# EAGLE design ai_pulsar (EAGLE 7.1.0)
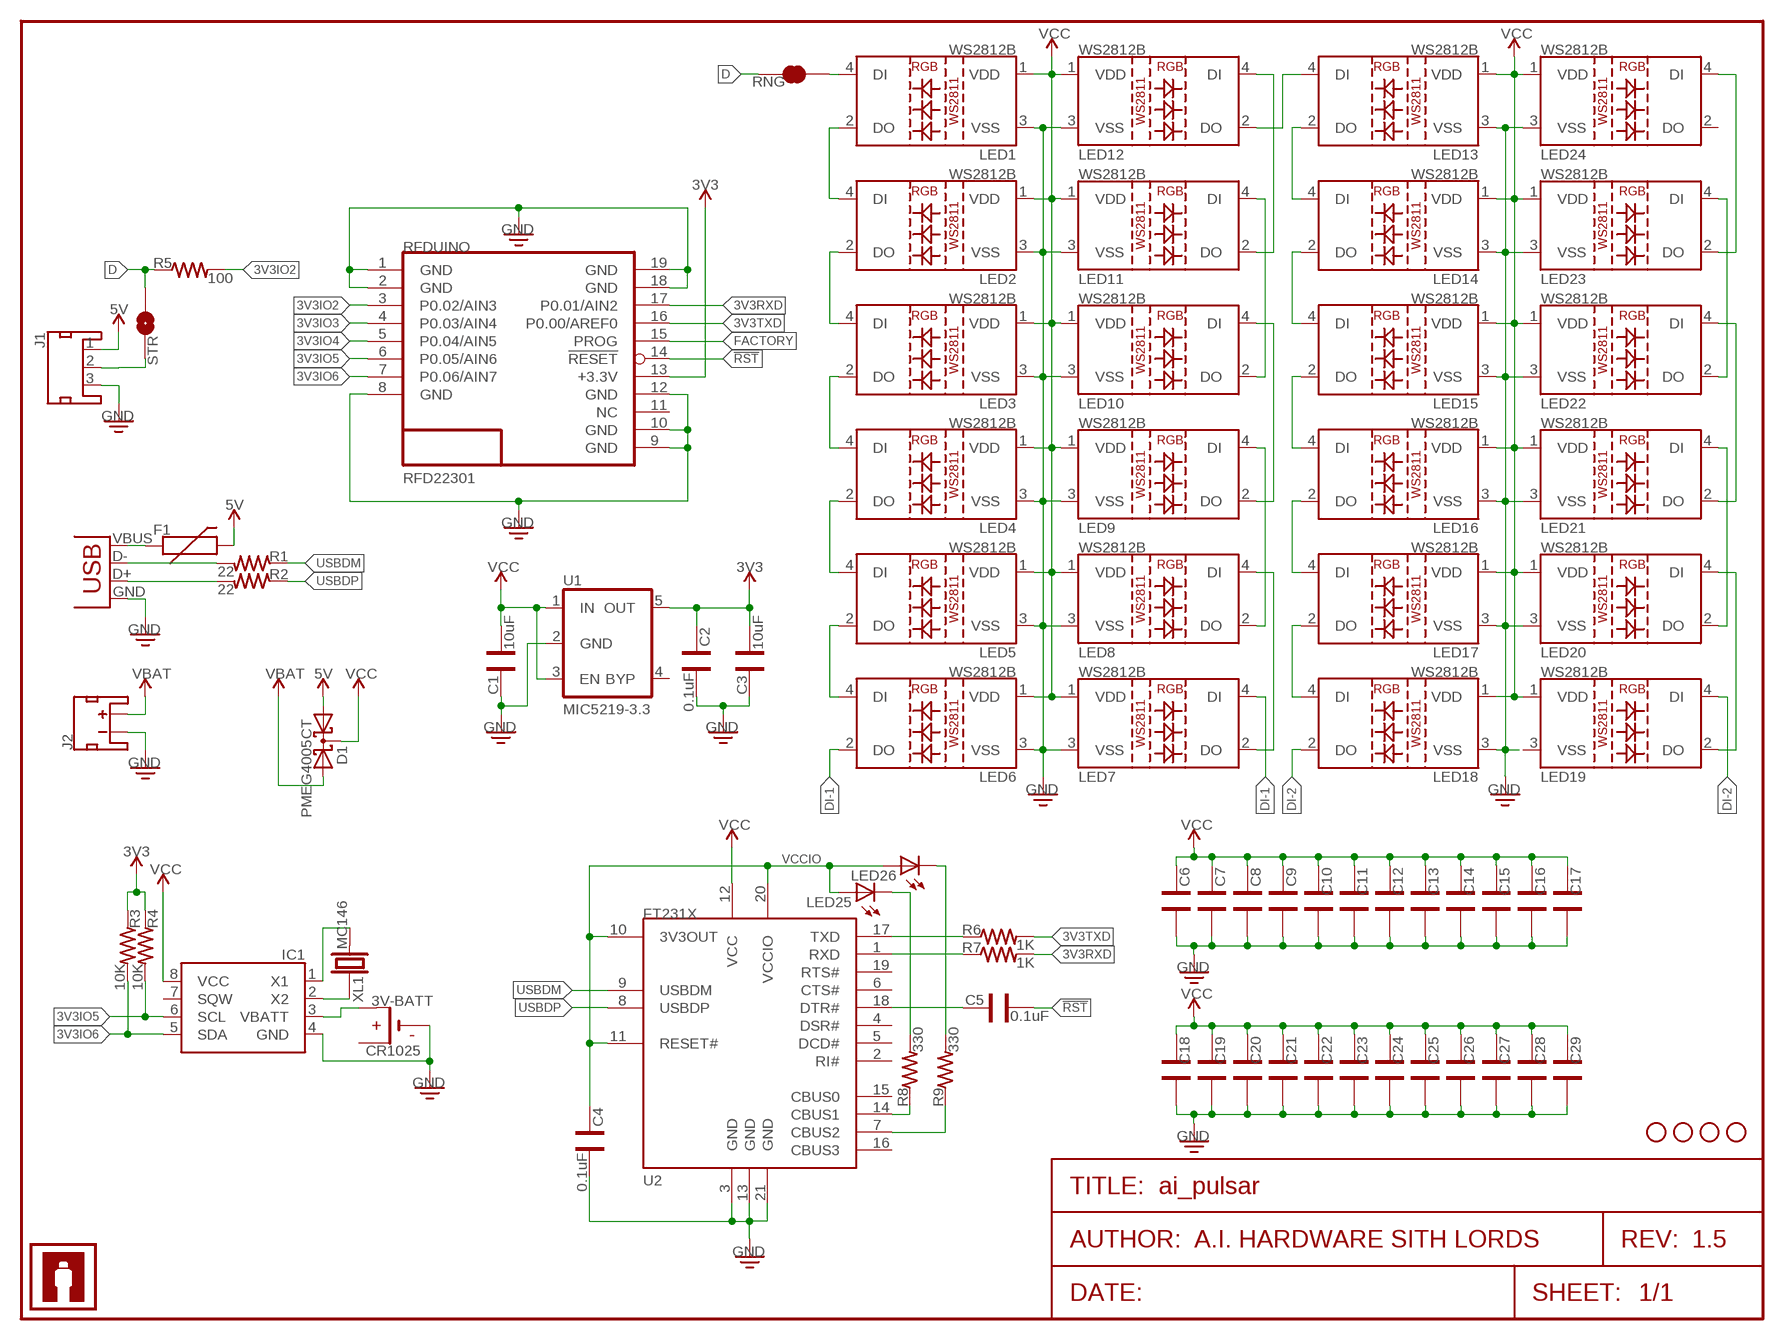
[diagram p0: schematic, sheet 1]
FRAME1 (FRAME-LETTER): AUTHOR: A.I. HARDWARE SITH LORDS; REV: 1.5

## Parts
3V-BATT  CR1025  [CR1025-SMD]
C1  10uF  CAP0603  [CAP-0603]
C2  0.1uF  CAP0603  [CAP-0603]
C3  10uF  CAP0603  [CAP-0603]
C4  0.1uF  CAP0603  [CAP-0603]
C5  0.1uF  CAP0603  [CAP-0603]
C6  CAP0603  [CAP-0603]
C7  CAP0603  [CAP-0603]
C8  CAP0603  [CAP-0603]
C9  CAP0603  [CAP-0603]
C10  CAP0603  [CAP-0603]
C11  CAP0603  [CAP-0603]
C12  CAP0603  [CAP-0603]
C13  CAP0603  [CAP-0603]
C14  CAP0603  [CAP-0603]
C15  CAP0603  [CAP-0603]
C16  CAP0603  [CAP-0603]
C17  CAP0603  [CAP-0603]
C18  CAP0603  [CAP-0603]
C19  CAP0603  [CAP-0603]
C20  CAP0603  [CAP-0603]
C21  CAP0603  [CAP-0603]
C22  CAP0603  [CAP-0603]
C23  CAP0603  [CAP-0603]
C24  CAP0603  [CAP-0603]
C25  CAP0603  [CAP-0603]
C26  CAP0603  [CAP-0603]
C27  CAP0603  [CAP-0603]
C28  CAP0603  [CAP-0603]
C29  CAP0603  [CAP-0603]
D1  PMEG4005CT  DIODE-SCHOTTKY-DUAL  [SOT-23]
F1  PTCSMD  [PTC-1206]
IC1  DS1307SO8-TIGHT  [SO08-TIGHT]
J1  JST-3P-MALE  [JST-3P-SMD]
J2  JST-2P-MALE  [JST-2P-SMD]
LED1  LED-WS2812B-SM  [LED-WS2812B-SM]
LED2  LED-WS2812B-SM  [LED-WS2812B-SM]
LED3  LED-WS2812B-SM  [LED-WS2812B-SM]
LED4  LED-WS2812B-SM  [LED-WS2812B-SM]
LED5  LED-WS2812B-SM  [LED-WS2812B-SM]
LED6  LED-WS2812B-SM  [LED-WS2812B-SM]
LED7  LED-WS2812B-SM  [LED-WS2812B-SM]
LED8  LED-WS2812B-SM  [LED-WS2812B-SM]
LED9  LED-WS2812B-SM  [LED-WS2812B-SM]
LED10  LED-WS2812B-SM  [LED-WS2812B-SM]
LED11  LED-WS2812B-SM  [LED-WS2812B-SM]
LED12  LED-WS2812B-SM  [LED-WS2812B-SM]
LED13  LED-WS2812B-SM  [LED-WS2812B-SM]
LED14  LED-WS2812B-SM  [LED-WS2812B-SM]
LED15  LED-WS2812B-SM  [LED-WS2812B-SM]
LED16  LED-WS2812B-SM  [LED-WS2812B-SM]
LED17  LED-WS2812B-SM  [LED-WS2812B-SM]
LED18  LED-WS2812B-SM  [LED-WS2812B-SM]
LED19  LED-WS2812B-SM  [LED-WS2812B-SM]
LED20  LED-WS2812B-SM  [LED-WS2812B-SM]
LED21  LED-WS2812B-SM  [LED-WS2812B-SM]
LED22  LED-WS2812B-SM  [LED-WS2812B-SM]
LED23  LED-WS2812B-SM  [LED-WS2812B-SM]
LED24  LED-WS2812B-SM  [LED-WS2812B-SM]
LED25  LED0603  [LED-0603]
LED26  LED0603  [LED-0603]
R1  22  RES0603  [RES-0603]
R2  22  RES0603  [RES-0603]
R3  10K  RES0603  [RES-0603]
R4  10K  RES0603  [RES-0603]
R5  100  RES0603  [RES-0603]
R6  1K  RES0603  [RES-0603]
R7  1K  RES0603  [RES-0603]
R8  330  RES0603  [RES-0603]
R9  330  RES0603  [RES-0603]
RFDUINO  RFD22301  [RFD22301]
RNG  1X02-SJ-NC  [1X02-SJ-NC]
STANDOFF1  STAND-OFF4T  [STAND-OFF-4T]
STANDOFF2  STAND-OFF4T  [STAND-OFF-4T]
STANDOFF3  STAND-OFF4T  [STAND-OFF-4T]
STANDOFF4  STAND-OFF4T  [STAND-OFF-4T]
STR  1X02-SJ-NO  [1X02-SJ-NO]
U1  MIC5219-3.3  [SOT23-5]
U2  FT231X-Q  [QFN20]
U$9  AI-LOGOXS  [AI-LOGO-XS]
USB1  USBMICROB-TH  [USB-MICROB-TH]
XL1  MC146  CRYSTALSMD  [EPSON-MC146]

## Nets
3V3 [PWR]: C2.2 C3.1 R3.1 R4.1 RFDUINO.13(+3.3V) U1.5(OUT)
3V3IO2: R5.2 RFDUINO.3(P0.02/AIN3)
3V3IO3: RFDUINO.4(P0.03/AIN4)
3V3IO4: RFDUINO.5(P0.04/AIN5)
3V3IO5: IC1.6(SCL) R4.2 RFDUINO.6(P0.05/AIN6)
3V3IO6: IC1.5(SDA) R3.2 RFDUINO.7(P0.06/AIN7)
3V3RXD: R7.2 RFDUINO.17(P0.01/AIN2)
3V3TXD: R6.2 RFDUINO.16(P0.00/AREF0)
5V [PWR]: D1.1(A1) F1.2 J1.1
!RST: C5.1 RFDUINO.14(!RESET)
D: J1.2 R5.1 RNG.2 STR.1
DI-1: LED6.2(DO) LED7.4(DI)
DI-2: LED18.2(DO) LED19.4(DI)
FACTORY: RFDUINO.15(PROG)
GND [PWR]: 3V-BATT.- C1.2 C2.1 C3.2 C4.1 C6.1 C7.1 C8.1 C9.1 C10.1 C11.1 C12.1 C13.1 C14.1 C15.1 C16.1 C17.1 C18.1 C19.1 C20.1 C21.1 C22.1 C23.1 C24.1 C25.1 C26.1 C27.1 C28.1 C29.1 IC1.4(GND) J1.3 J2.2(-) LED1.3(VSS) LED2.3(VSS) LED3.3(VSS) LED4.3(VSS) LED5.3(VSS) LED6.3(VSS) LED7.3(VSS) LED8.3(VSS) LED9.3(VSS) LED10.3(VSS) LED11.3(VSS) LED12.3(VSS) LED13.3(VSS) LED14.3(VSS) LED15.3(VSS) LED16.3(VSS) LED17.3(VSS) LED18.3(VSS) LED19.3(VSS) LED20.3(VSS) LED21.3(VSS) LED22.3(VSS) LED23.3(VSS) LED24.3(VSS) RFDUINO.1(GND) RFDUINO.2(GND) RFDUINO.8(GND) RFDUINO.9(GND) RFDUINO.10(GND) RFDUINO.12(GND) RFDUINO.18(GND) RFDUINO.19(GND) U1.2(GND) U2.3(GND) U2.13(GND) U2.21(GND) USB1.GND
N$1: 3V-BATT.+@1(+1) 3V-BATT.+@2(+1) IC1.3(VBATT)
N$2: R1.2 USB1.D-
N$3: IC1.2(X2) XL1.P$1
N$4: IC1.1(X1) XL1.P$2
N$5: F1.1 USB1.VBUS
N$6: R2.2 USB1.D+
N$7: R7.1 U2.1(RXD)
N$8: R6.1 U2.17(TXD)
N$10: C5.2 U2.18(DTR#)
N$11: LED26.C R9.2
N$12: LED25.C R8.2
N$13: LED12.2(DO) LED13.4(DI)
N$14: R8.1 U2.14(CBUS1)
N$15: R9.1 U2.7(CBUS2)
N$16: LED2.2(DO) LED3.4(DI)
N$17: STR.2
N$18: LED3.2(DO) LED4.4(DI)
N$19: LED4.2(DO) LED5.4(DI)
N$20: LED5.2(DO) LED6.4(DI)
N$21: LED7.2(DO) LED8.4(DI)
N$22: LED8.2(DO) LED9.4(DI)
N$23: LED9.2(DO) LED10.4(DI)
N$24: LED10.2(DO) LED11.4(DI)
N$25: LED11.2(DO) LED12.4(DI)
N$26: LED13.2(DO) LED14.4(DI)
N$27: LED14.2(DO) LED15.4(DI)
N$28: LED15.2(DO) LED16.4(DI)
N$29: LED16.2(DO) LED17.4(DI)
N$30: LED1.4(DI) RNG.1
N$31: LED1.2(DO) LED2.4(DI)
N$32: LED17.2(DO) LED18.4(DI)
N$33: LED19.2(DO) LED20.4(DI)
N$34: LED20.2(DO) LED21.4(DI)
N$35: LED21.2(DO) LED22.4(DI)
N$36: LED22.2(DO) LED23.4(DI)
N$37: LED23.2(DO) LED24.4(DI)
USBDM: R1.1 U2.9(USBDM)
USBDP: R2.1 U2.8(USBDP)
VBAT: D1.2(A2) J2.1(+)
VCC: C1.1 C6.2 C7.2 C8.2 C9.2 C10.2 C11.2 C12.2 C13.2 C14.2 C15.2 C16.2 C17.2 C18.2 C19.2 C20.2 C21.2 C22.2 C23.2 C24.2 C25.2 C26.2 C27.2 C28.2 C29.2 D1.3(CC) IC1.8(VCC) LED1.1(VDD) LED2.1(VDD) LED3.1(VDD) LED4.1(VDD) LED5.1(VDD) LED6.1(VDD) LED7.1(VDD) LED8.1(VDD) LED9.1(VDD) LED10.1(VDD) LED11.1(VDD) LED12.1(VDD) LED13.1(VDD) LED14.1(VDD) LED15.1(VDD) LED16.1(VDD) LED17.1(VDD) LED18.1(VDD) LED19.1(VDD) LED20.1(VDD) LED21.1(VDD) LED22.1(VDD) LED23.1(VDD) LED24.1(VDD) U1.1(IN) U1.3(EN) U2.12(VCC)
VCCIO [PWR]: C4.2 LED25.A LED26.A U2.10(3V3OUT) U2.11(RESET#) U2.20(VCCIO)
Unconnected: IC1.7(SQW) LED24.2(DO) RFDUINO.11(NC) U1.4(BYP) U2.2(RI#) U2.4(DSR#) U2.5(DCD#) U2.6(CTS#) U2.15(CBUS0) U2.16(CBUS3) U2.19(RTS#)

## Library data of the parts
3V-BATT = Ai_Connectors:CR1025
C1-C29 = Ai_Passives:CAP
D1 = Ai_DiscreteSemis:DIODE-SCHOTTKY-DUAL: Schottky Diodes Source: Fairchild .. BAT54.pdf
F1 = Ai_Passives:PTC
IC1 = Ai_IC:DS1307
J1 = Ai_Connectors:JST-3P-MALE
J2 = Ai_Connectors:JST-2P-MALE
LED1-LED24 = Ai_LED:LED-WS2812B
LED25 LED26 = Ai_LED:LED
R1-R9 = Ai_Passives:RES: Part # blah Digikey
RFDUINO = Ai_RF:RFD22301: RF Digital RFD22301
RNG = Ai_Connectors:1X02-SJ-NC
STANDOFF1-STANDOFF4 = Ai_Electromechanical:STAND-OFF: Size #4
STR = Ai_Connectors:1X02-SJ-NO: A.I. Device 1x02-SJ-* NC has a large amount of paste (see paste layer) so that it should jumper during reflow. Remember that we have a version with a buil-in trace, which needs to be cut in order to have the jumper be NO.
U1 = Ai_Power:MIC5219-*
U2 = Ai_IC:FT231X
U$9 = Ai_Miscellany:AI-LOGO
USB1 = Ai_Connectors:USB
XL1 = Ai_FrequencyControl:CRYSTAL: Cylinder: CMR200T-32.768KDZBT

## Net classes
0 default: width 0.254 mm
1 PWR: width 0.305 mm
5 GND: width 0.203 mm

## Board
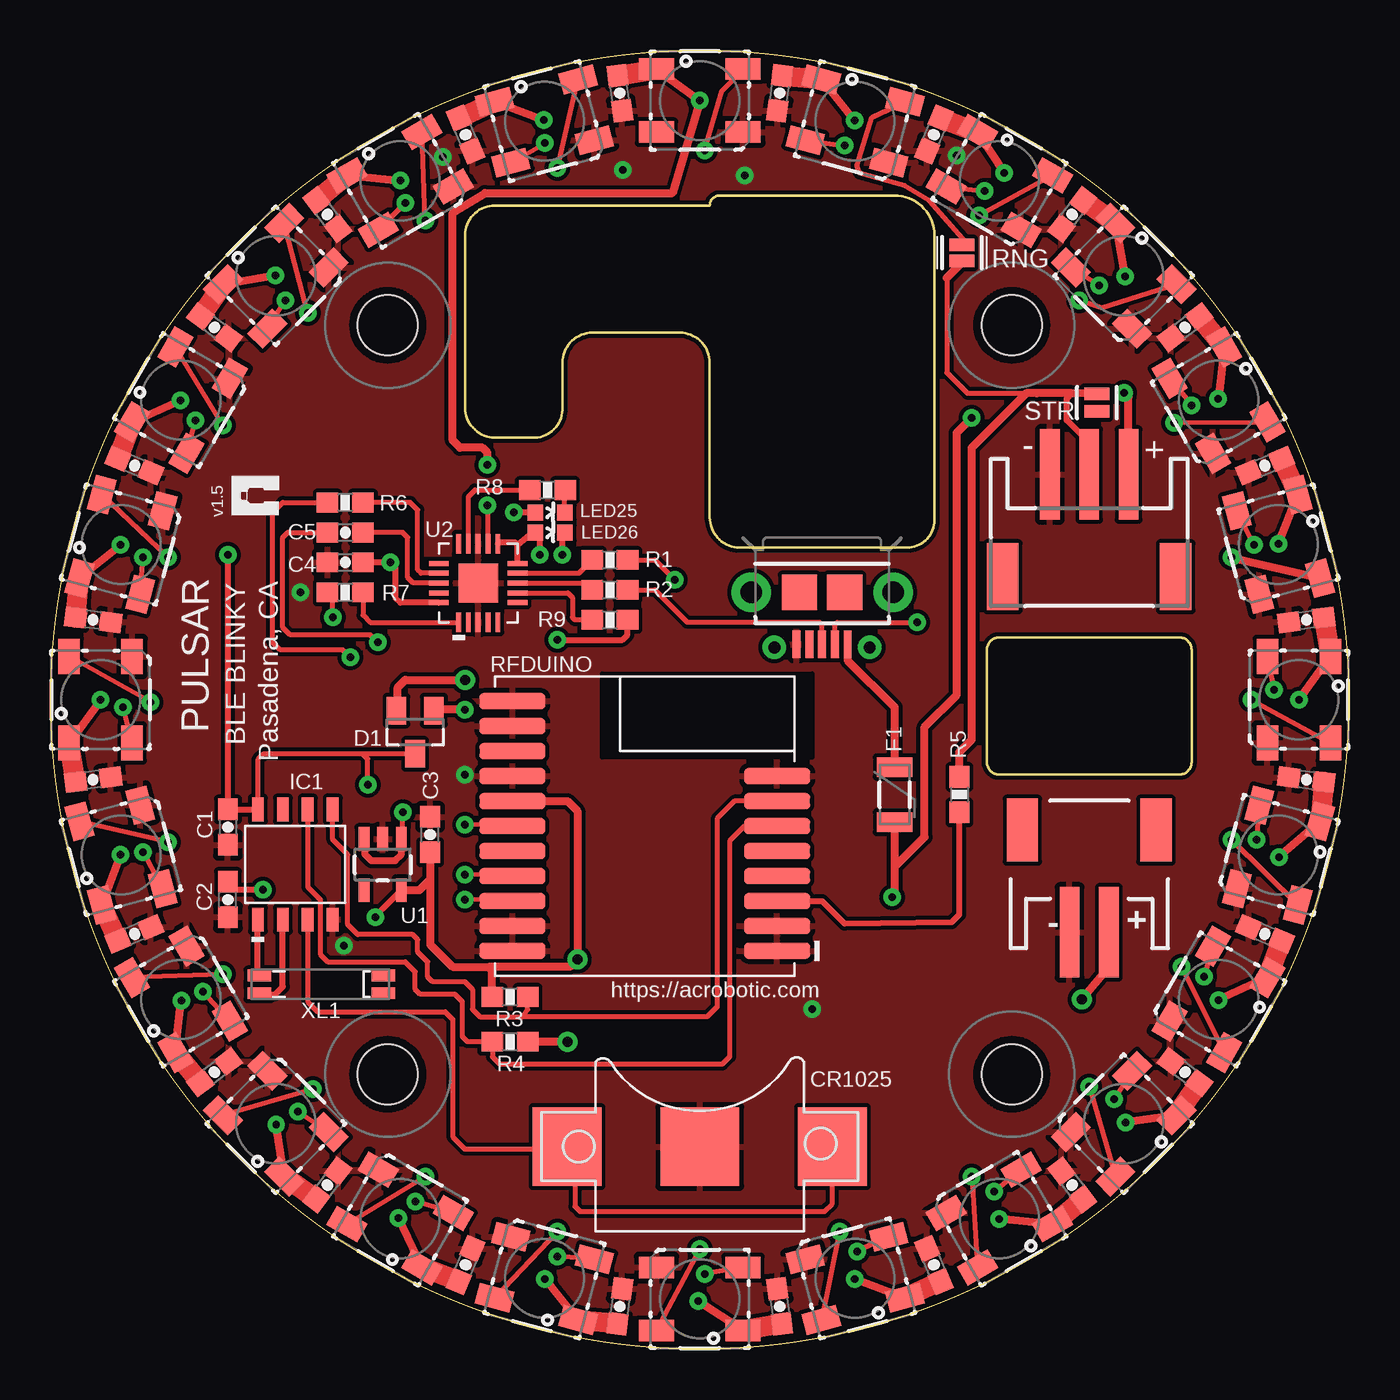
[diagram p1: board, top side]
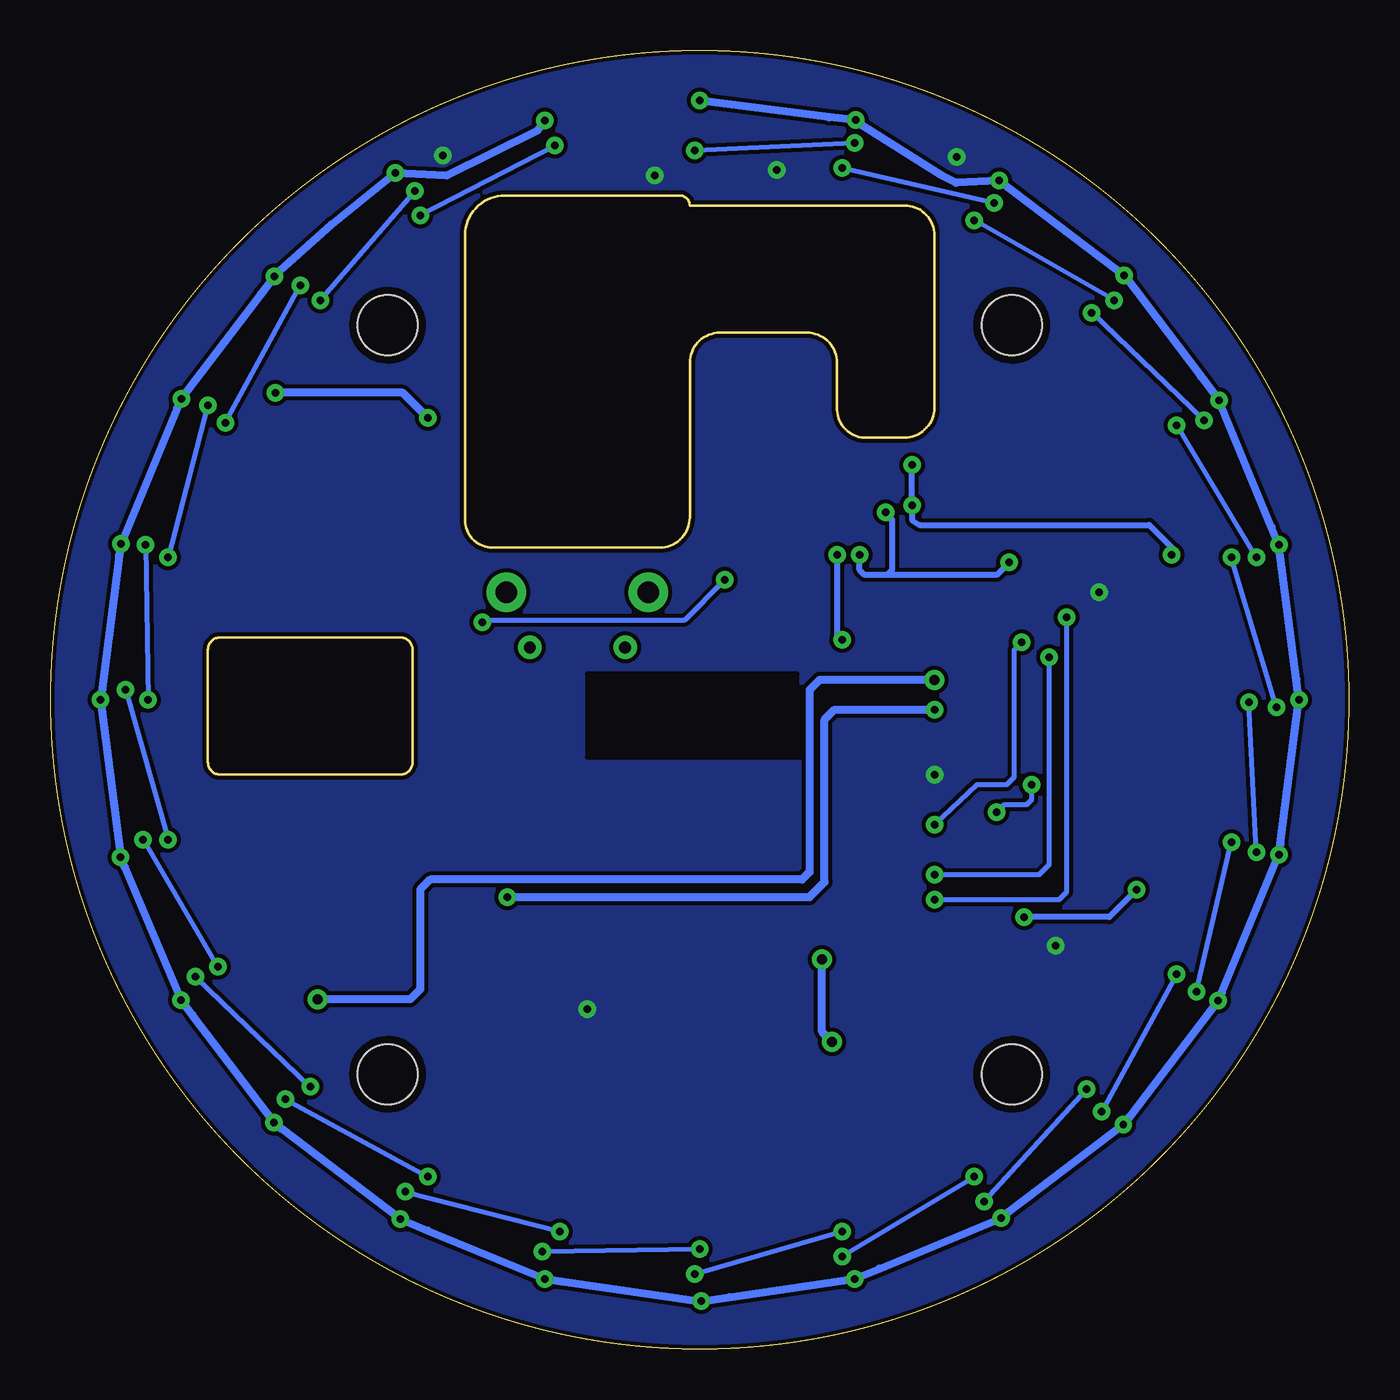
[diagram p2: board, bottom side, seen from below]

Size 66.04 x 66.04 mm. Coordinates in mm from the lower left corner, seen from the top.
Outline: 22.61,58.17 33.53,58.17 arc-90 34.04,58.67 42.93,58.67 arc-90 44.96,56.64 44.96,42.29 arc-90 43.69,40.77 35.05,40.77 arc-90 33.53,42.29 33.53,50.16 arc90 32,51.69 27.56,51.69 arc90 26.04,50.16 26.04,47.75 arc-90 24.51,46.35 22.61,46.35 arc-90 21.08,47.88 21.08,56.64 arc-90 22.61,58.17
Outline: 48.26,36.2 57.4,36.2 arc-90 58.04,35.56 58.04,29.84 arc-90 57.4,29.21 48.26,29.21 arc-90 47.62,29.84 47.62,35.56 arc-90 48.26,36.2
Outline: circle at 33.02,33.02 radius 33.02
Copper layers (1*16): Top 0.035mm / dielectric 1.5mm / Bottom 0.035mm
Design rules "ai_2layer_qfn": minimum track width 7mil, minimum drill 15mil, track to track 8mil, track to pad 8mil, pad to pad 8mil, via to via 8mil, smd to smd 8mil, copper to edge 8mil, drill to drill 8mil, minimum pad ring 1mil, minimum via ring 10mil, stop-mask expansion 4mil, vias tented up to drill 20mil, thermal gap 10mil
tRestrict: area 28.1,30.1 to 38.7,34.3
bRestrict: area 28.1,30.1 to 38.7,34.3

### Footprints (pad centres in the part's own frame; a part is rotated, then mirrored left to right if it is on the bottom)
CR1025-SMD = smd 3.5 x 4: +@1 -6.75,0; +@2 6.75,0 | smd 4 x 4: - 0,0
CAP-0603 = smd 1.1 x 1: 1 -0.9,0; 2 0.9,0
SOT-23 = smd 1 x 1.4: 1 -0.95,-1.1; 2 0.95,-1.1; 3 0,1.1
PTC-1206 = smd 1 x 1.8: 1 -1.4,0; 2 1.4,0
SO08-TIGHT = smd 0.6 x 1.2: 1 -1.905,-2.8; 2 -0.635,-2.8; 3 0.635,-2.8; 4 1.905,-2.8; 5 1.905,2.8; 6 0.635,2.8; 7 -0.635,2.8; 8 -1.905,2.8
JST-3P-SMD = smd 1 x 4.6: 1 -2,-2.7; 2 0,-2.7; 3 2,-2.7 | smd 1.6 x 3.4: NC1 -4.4,2.5; NC2 4.4,2.5
JST-2P-SMD = smd 1 x 4.6: 1 1,-3.7; 2 -1,-3.7 | smd 1.6 x 3.2: NC1 -3.4,1.5; NC2 3.4,1.5
LED-WS2812B-SM = smd 1.8 x 1.1: 1 -2.2,1.6; 2 -2.2,-1.6; 3 2.2,-1.6; 4 2.2,1.6
LED-0603 = smd 0.8 x 0.8: A 0,-0.75; C 0,0.75
RES-0603 = smd 1.1 x 1: 1 -0.9,0; 2 0.9,0
RFD22301 = smd 3.353 x 0.813: 1 -6.731,6.35; 2 -6.731,5.08; 3 -6.731,3.81; 4 -6.731,2.54; 5 -6.731,1.27; 6 -6.731,0; 7 -6.731,-1.27; 8 -6.731,-2.54; 9 6.731,-6.35; 10 6.731,-5.08; 11 6.731,-3.81; 12 6.731,-2.54; 13 6.731,-1.27; 14 6.731,0; 15 6.731,1.27; 16 6.731,2.54; 17 6.731,3.81; 18 6.731,5.08; 19 6.731,6.35
1X02-SJ-NC = smd 0.635 x 1.27: 1 -0.401,0; 2 0.413,0
STAND-OFF-4T = hole 3.048: 0,0
1X02-SJ-NO = smd 0.635 x 1.27: 1 -0.45,0; 2 0.45,0
SOT23-5 = smd 0.55 x 1.2: 1 -0.95,-1.3; 2 0,-1.3; 3 0.95,-1.3; 4 0.95,1.3; 5 -0.95,1.3
QFN20 = smd 1 x 0.25: 1 -2.032,0.968; 2 -2.032,0.468; 3 -2.032,-0.032; 4 -2.032,-0.532; 5 -2.032,-1.032; 11 1.968,-1.032; 12 1.968,-0.532; 13 1.968,-0.032; 14 1.968,0.468; 15 1.968,0.968 | smd 0.25 x 1: 6 -1.032,-2.032; 7 -0.532,-2.032; 8 -0.032,-2.032; 9 0.468,-2.032; 10 0.968,-2.032; 16 0.968,1.968; 17 0.468,1.968; 18 -0.032,1.968; 19 -0.532,1.968; 20 -1.032,1.968 | smd 2 x 2: 21 -0.032,-0.032
USB-MICROB-TH = smd 0.4 x 1.4: D+ 0,2.65; D- -0.65,2.65; GND 1.3,2.65; ID 0.65,2.65; VBUS -1.3,2.65 | smd 1.8 x 1.8: M5 -1.15,0; M6 1.15,0 | drill 0.6 pad 1.2: MT1 -2.425,2.8; MT2 2.425,2.8 | drill 1.1 pad 2: MT3 -3.61,0; MT4 3.61,0
EPSON-MC146 = smd 1.2 x 0.6: NC1 3.2,0.45; NC2 3.2,-0.45; P$1 -3.1,-0.45; P$2 -3.1,0.45

### Placement (x,y rotation side)
3V-BATT  33.02,10.29 0 top
C1  9.02,26.54 270 top
C2  9.02,22.86 90 top
C3  19.3,26.16 90 top
C4  14.99,40.01 0 top
C5  14.99,41.53 0 top
C6  44.93,61.77 67.5 top
C7  51.97,57.71 52.5 top
C8  57.71,51.97 37.5 top
C9  61.77,44.93 22.5 top
C10  63.88,37.08 7.5 top
C11  63.88,28.96 352.5 top
C12  61.77,21.11 337.5 top
C13  57.71,14.07 322.5 top
C14  51.97,8.33 307.5 top
C15  44.93,4.27 292.5 top
C16  37.08,2.16 277.5 top
C17  28.96,2.16 262.5 top
C18  21.11,4.27 247.5 top
C19  14.07,8.33 232.5 top
C20  8.33,14.07 217.5 top
C21  4.27,21.11 202.5 top
C22  2.16,28.96 187.5 top
C23  2.16,37.08 172.5 top
C24  4.27,44.93 157.5 top
C25  8.33,51.97 142.5 top
C26  14.07,57.71 127.5 top
C27  21.11,61.77 112.5 top
C28  28.96,63.88 97.5 top
C29  37.08,63.88 82.5 top
D1  18.54,31.37 180 top
F1  42.93,28.19 270 top
IC1  12.45,24.64 0 top
J1  52.83,41.78 180 top
J2  52.83,24.89 0 top
LED1  40.92,62.46 345 top
LED2  48.26,59.41 330 top
LED3  54.58,54.58 315 top
LED4  59.41,48.26 300 top
LED5  62.46,40.92 285 top
LED6  63.5,33.02 270 top
LED7  62.46,25.12 255 top
LED8  59.41,17.78 240 top
LED9  54.58,11.46 225 top
LED10  48.26,6.63 210 top
LED11  40.92,3.58 195 top
LED12  33.02,2.54 180 top
LED13  25.12,3.58 165 top
LED14  17.78,6.63 150 top
LED15  11.46,11.46 135 top
LED16  6.63,17.78 120 top
LED17  3.58,25.12 105 top
LED18  2.54,33.02 90 top
LED19  3.58,40.92 75 top
LED20  6.63,48.26 60 top
LED21  11.46,54.58 45 top
LED22  17.78,59.41 30 top
LED23  25.12,62.46 15 top
LED24  33.02,63.5 0 top
LED25  25.4,42.55 270 top
LED26  25.4,41.53 270 top
R1  28.45,40.13 0 top
R2  28.45,38.61 0 top
R3  23.37,17.91 0 top
R4  23.37,15.62 180 top
R5  46.23,28.19 270 top
R6  14.99,43.05 180 top
R7  14.99,38.48 180 top
R8  25.27,43.69 0 top
R9  28.45,37.08 0 top
RFDUINO  30.23,26.59 180 top
RNG  46.35,55.75 270 top
STANDOFF1  17.14,52.07 0 top
STANDOFF2  17.14,13.97 0 top
STANDOFF3  48.9,13.97 0 top
STANDOFF4  48.9,52.07 0 top
STR  53.21,48.13 270 top
U1  16.89,24.64 180 top
U2  21.72,38.99 90 top
U$9  11.58,42.42 90 top
USB1  39.24,38.48 180 top
XL1  13.72,18.54 0 top

### Tracks (layer width: path | path; a pad name or v marks a point on that pad's centre or on a via)
3V3  (via drill 0.38, 0.51)
  Top 0.305: C2.2 9.41,23.37 v10.79,23.37 | U1.5 16.89,22.39 v16.51,21.97
  Top 0.406: C3.1 19.3,23.88 | 19.3,23.88 19.3,20.57 20.45,19.43 22.35,19.43 | RFDUINO.13 26.29,27.86 26.8,27.36 v26.8,19.81 26.42,19.43 22.35,19.43 | R3.1 22.47,19.19 22.35,19.43 | v26.29,15.62 R4.1 | U1.5 18.77,23.34 19.3,23.88
  Bottom 0.305: v10.79,23.37 12.19,21.97 v16.51,21.97
  Bottom 0.406: v26.29,15.62 26.8,16.13 v26.8,19.81
3V3IO2
  Top 0.305: RFDUINO.3 39.24,22.78 40.39,21.64 45.85,21.72 46.23,22.1 R5.2
3V3IO5
  Top 0.254: RFDUINO.6 35.31,26.59 34.54,25.83 34.54,14.86 34.16,14.48 22.86,14.48 22.48,14.86 R4.2 21.21,15.62 20.95,15.88 20.95,17.65 20.57,18.03 18.8,18.03 18.54,18.29 18.54,19.18 18.03,19.68 14.1,19.68 13.72,20.07 13.72,22.86 13.08,23.5 IC1.6
3V3IO6
  Top 0.254: IC1.5 14.35,25.91 15.11,25.15 15.11,21.59 15.62,21.08 18.41,21.08 18.67,20.83 18.67,20.19 19.18,19.68 19.18,18.92 19.43,18.67 21.08,18.67 21.46,18.29 21.46,17.27 21.84,16.89 24,16.89 | RFDUINO.7 34.8,27.86 33.91,26.98 33.91,17.4 33.4,16.89 24,16.89 | 24,16.89 24.27,17.26 R3.2
3V3RXD  (via drill 0.38)
  Top 0.254: RFDUINO.17 v21.08,22.86 | v14.35,37.21 14.35,38.24 R7.2
  Bottom 0.254: v21.08,22.86 14.73,22.86 14.35,23.24 v14.35,37.21
3V3TXD  (via drill 0.38)
  Top 0.254: RFDUINO.16 v21.08,24.13 | v15.24,35.18 14.86,35.56 11.68,35.56 11.3,35.94 11.3,42.55 11.81,43.05 R6.2
  Bottom 0.254: v21.08,24.13 15.75,24.13 15.24,24.64 v15.24,35.18
5V  (via drill 0.38)
  Top 0.406: F1.2 42.93,24.51 | 42.93,24.51 44.45,26.04 44.45,31.62 46.1,33.27 46.1,46.61 v46.86,47.37 | J1.1 54.83,48.42 v54.61,48.64 | 42.93,24.51 42.93,23.11 v42.8,22.99 | v21.08,32.51 19.54,32.51 D1.1
  Bottom 0.406: v46.86,47.37 48.13,48.64 v54.61,48.64 | v42.8,22.99 27.43,22.99 26.67,23.75 26.67,32 26.16,32.51 v21.08,32.51
!RST  (via drill 0.38)
  Top 0.254: RFDUINO.14 v21.08,26.67 | v16.64,35.94 16.26,36.32 12.19,36.32 11.81,36.7 11.81,41.27 12.06,41.53 C5.1
  Bottom 0.254: v21.08,26.67 18.92,28.7 17.4,28.7 17.02,29.08 17.02,35.56 v16.64,35.94
D
  Top 0.254: 45.59,54.48 45.59,49.66 46.64,48.61 50.16,48.61
  Top 0.305: J1.2 52.83,46.1 51.69,47.24 51.69,48.34 51.96,48.61
  Top 0.406: R5.1 46.23,30.35 46.86,30.99 46.86,45.85 49.62,48.61 50.16,48.61 51.96,48.61 STR.1 | 45.59,54.48 46.48,55.37 RNG.2
DI-1  (via drill 0.38)
  Top 0.254: LED6.2 v62.23,33.53 | v60.07,25.91 LED7.4
  Bottom 0.254: v62.23,33.53 v60.07,25.91
DI-2  (via drill 0.38)
  Top 0.254: LED18.2 v3.68,32.64 | v5.97,40.26 LED19.4
  Bottom 0.254: v3.68,32.64 v5.97,40.26
GND  (via drill 0.38)
  other vias: 35.31,59.69 29.11,59.97 12.7,38.48 38.73,17.27 14.92,20.51 21.08,29.21 46.1,60.71 19.94,60.63
  pour Top: 0,0 0,66.04 66.04,66.04 66.04,0
  pour Bottom: 0,0 0,66.04 66.04,66.04 66.04,0
N$1
  Top 0.254: IC1.3 13.08,17.65 13.59,17.14 20.07,17.14 20.45,16.76 20.45,10.79 21.08,10.16 26.14,10.16 3V-BATT.+@1 26.67,9.89 26.67,7.24 26.92,6.99 39.37,6.99 39.77,7.38 3V-BATT.+@2
N$2  (via drill 0.38)
  Top 0.254: USB1.D- 39.88,36.83 40,36.96 v44.07,36.96 | R1.2 30.73,40.13 v31.75,39.12
  Bottom 0.254: v44.07,36.96 43.94,37.08 33.78,37.08 v31.75,39.12
N$3
  Top 0.305: IC1.2 11.81,18.41 11.43,18.03 10.69,18.03 XL1.P$1
N$4
  Top 0.305: 10.57,21.8 IC1.1 10.54,19.19 XL1.P$2
N$5
  Top 0.406: USB1.VBUS 40.54,35.02 42.93,32.64 F1.1
N$6
  Top 0.254: R2.2 30.73,38.61 32.38,36.96 39.12,36.96 39.24,36.83 USB1.D+
N$7
  Top 0.254: R7.1 15.89,37.33 16.26,36.96 U2.1
N$8
  Top 0.254: U2.17 18.84,39.46 18.67,39.62 18.67,42.67 18.29,43.05 R6.1
N$10
  Top 0.254: U2.18 18.45,38.96 18.16,39.24 18.16,41.27 17.91,41.53 C5.2
N$11  (via drill 0.38)
  Top 0.305: v25.78,36.07 29.08,36.07 29.34,36.32 R9.2 | v26.04,40.39 26.04,41.39 LED26.C
  Bottom 0.305: v26.04,40.39 26.04,36.32 v25.78,36.07
N$12
  Top 0.254: LED25.C 26.15,43.66 R8.2
N$13  (via drill 0.38)
  Top 0.254: LED12.2 v33.27,3.81 | v25.78,5.97 LED13.4
  Bottom 0.254: v33.27,3.81 v25.78,5.97
N$14
  Top 0.254: U2.14 21.25,43.35 21.59,43.69 R8.1
N$15
  Top 0.254: U2.7 26.31,38.46 26.54,38.23 26.54,37.21 26.67,37.08 R9.1
N$16  (via drill 0.38)
  Top 0.254: LED2.2 v47.52,58.9 | v52.32,53.34 53.47,52.96 LED3.4
  Bottom 0.254: v47.52,58.9 v52.32,53.34
N$18  (via drill 0.38)
  Top 0.254: LED3.2 v53.34,54.1 | v57.15,47.12 LED4.4
  Bottom 0.254: v53.34,54.1 v57.15,47.12
N$19  (via drill 0.38)
  Top 0.254: LED4.2 v58.04,48.01
  Top 0.406: v60.07,40.26 LED5.4
  Bottom 0.254: v58.04,48.01 v60.07,40.26
N$20  (via drill 0.38)
  Top 0.254: LED5.2 v61.21,40.89 | v61.09,33.02 LED6.4
  Bottom 0.254: v61.21,40.89 v61.09,33.02
N$21  (via drill 0.38)
  Top 0.254: LED7.2 v61.34,25.91 | v57.53,19.43 LED8.4
  Bottom 0.254: v61.34,25.91 v57.53,19.43
N$22  (via drill 0.38)
  Top 0.254: LED8.2 v58.67,18.92 | v52.83,13.34 LED9.4
  Bottom 0.254: v58.67,18.92 v52.83,13.34
N$23  (via drill 0.38)
  Top 0.254: LED9.2 v54.1,12.7 | v46.86,8.76 LED10.4
  Bottom 0.254: v54.1,12.7 v46.86,8.76
N$24  (via drill 0.38)
  Top 0.254: LED10.2 v48.01,8 | v40.13,5.97 LED11.4
  Bottom 0.254: v48.01,8 v40.13,5.97
N$25  (via drill 0.38)
  Top 0.254: LED11.2 v41.02,4.95 | v33.02,5.08 LED12.4
  Bottom 0.254: v41.02,4.95 v33.02,5.08
N$26  (via drill 0.38)
  Top 0.254: LED13.2 v25.78,4.7 | v19.05,8.76 LED14.4
  Bottom 0.254: v25.78,4.7 v19.05,8.76
N$27  (via drill 0.38)
  Top 0.254: LED14.2 v18.54,7.49 | v13.34,13.21 LED15.4
  Bottom 0.254: v18.54,7.49 v13.34,13.21
N$28  (via drill 0.38)
  Top 0.254: LED15.2 v12.57,12.06 | v8.76,19.05 LED16.4
  Bottom 0.254: v12.57,12.06 v8.76,19.05
N$29  (via drill 0.38)
  Top 0.254: LED16.2 v7.75,18.16 | v5.97,25.78 LED17.4
  Bottom 0.254: v7.75,18.16 v5.97,25.78
N$30
  Top 0.254: RNG.1 46.59,56.28 44.7,58.42 43.43,59.18 41.15,59.82 41.02,60.2 41.78,62.65 LED1.4
N$31  (via drill 0.38)
  Top 0.254: LED1.2 v40.39,61.21 | v47.24,57.66 LED2.4
  Bottom 0.254: v40.39,61.21 v47.24,57.66
N$32  (via drill 0.38)
  Top 0.254: LED17.2 v4.7,25.27 | v5.08,32.89 LED18.4
  Bottom 0.254: v4.7,25.27 v5.08,32.89
N$33  (via drill 0.38)
  Top 0.254: LED19.2 v4.7,40.26 | v8.76,46.99 LED20.4
  Bottom 0.254: v4.7,40.26 v8.76,46.99
N$34  (via drill 0.38)
  Top 0.254: LED20.2 v7.37,47.24 | v13.08,52.7 LED21.4
  Bottom 0.254: v7.37,47.24 v13.08,52.7
N$35  (via drill 0.38)
  Top 0.254: LED21.2 v11.94,53.34 | v19.05,57.4 LED22.4
  Bottom 0.254: v11.94,53.34 v19.05,57.4
N$36  (via drill 0.38)
  Top 0.254: LED22.2 v18.03,58.29 | v25.78,60.07 LED23.4
  Bottom 0.254: v18.03,58.29 v25.78,60.07
N$37  (via drill 0.38)
  Top 0.254: LED23.2 v25.15,61.34 | v33.27,60.96 34.16,64.01 LED24.4
  Bottom 0.254: v25.15,61.34 v33.27,60.96
USBDM
  Top 0.254: U2.9 26.87,39.46 R1.1
USBDP
  Top 0.254: U2.8 27.2,38.96 R2.1
VBAT  (via drill 0.51)
  Top 0.406: D1.2 17.65,32.53 17.65,33.66 18.03,34.04 v21.08,34.04 | v52.45,17.78 53.83,19.41 J2.1
  Bottom 0.406: v21.08,34.04 26.92,34.04 27.43,33.53 27.43,24.26 27.81,23.88 46.74,23.88 47.24,23.37 47.24,18.29 47.75,17.78 v52.45,17.78
VCC  (via drill 0.38)
  Top 0.254: D1.3 15.88,30.27 | 15.88,30.27 10.84,30.27 10.54,29.97 IC1.8 | 17.91,26 v17.91,27.3 | v16.13,28.7 16.13,30.02 15.88,30.27 | U2.12 22.25,42.9 v22.23,42.9
  Top 0.305: IC1.8 C1.1 v9.02,40.39 | U1.1 17.91,26
  Top 0.356: U1.3 15.98,25.9 15.98,25.17 16.31,24.84 17.53,24.84 17.84,25.16 U1.1
  Top 0.406: LED1.1 v40.89,62.48 | LED24.1 v33.02,63.5 31.62,58.8 22.1,58.8 20.45,57.78 20.45,46.23 20.83,45.85 21.97,45.85 22.23,45.59 v22.23,44.96 | LED2.1 v48.51,59.82 | LED3.1 v54.66,54.55 | LED4.1 v59.39,48.32 | LED5.1 v62.46,40.96 | LED6.1 v63.5,33.02 | LED7.1 v62.48,25.02 | LED8.1 v59.41,17.74 | LED9.1 v54.67,11.51 | LED10.1 v48.26,6.6 | LED11.1 v40.89,3.56 | LED12.1 v32.93,2.43 | LED13.1 v25.15,3.56 | LED14.1 v17.7,6.67 | LED15.1 v11.47,11.4 | LED16.1 v6.65,17.72 | LED17.1 v3.56,25.15 | LED18.1 v2.54,33.02 | LED19.1 v3.56,40.89 | LED20.1 v6.6,48.26 | LED21.1 v11.43,54.61 | LED22.1 v17.78,59.44 | LED23.1 v25.08,62.51
  Top 1.016: C27.2 LED23.1 | C28.2 LED24.1 | C29.2 LED1.1 | C6.2 LED2.1 | C7.2 LED3.1 | C8.2 LED4.1 | C9.2 LED5.1 | C10.2 LED6.1 | C11.2 LED7.1 | C12.2 LED8.1 | C13.2 LED9.1 | C14.2 LED10.1 | C15.2 LED11.1 | C16.2 LED12.1 | C17.2 LED13.1 | C18.2 LED14.1 | C19.2 LED15.1 | C20.2 LED16.1 | C21.2 LED17.1 | C22.2 LED18.1 | C23.2 LED19.1 | C24.2 LED20.1 | C25.2 LED21.1 | C26.2 LED22.1
  Bottom 0.254: v17.91,27.3 17.53,27.69 16.38,27.69 16.13,27.94 v16.13,28.7
  Bottom 0.305: v22.23,44.96 v22.23,42.9 22.23,42.16 21.84,41.91 10.16,41.91 9.02,40.77 v9.02,40.39
  Bottom 0.406: v40.89,62.48 41.27,61.98 45.9,59.69 v48.51,59.82 51.75,57.19 54.61,54.61 v54.66,54.55 | v54.66,54.55 v59.39,48.32 | v59.39,48.32 59.44,48.26 59.61,47.84 | 59.61,47.84 v62.46,40.96 | v62.46,40.96 62.48,40.89 62.55,40.36 | 62.55,40.36 v63.5,33.02 63.44,32.54 v62.48,25.02 62.26,24.5 59.44,17.78 v59.41,17.74 58.84,16.99 v54.67,11.51 | v54.67,11.51 54.61,11.43 54.33,11.21 | 54.33,11.21 v48.26,6.6 46.84,6.02 v40.89,3.56 40.06,3.44 33.02,2.41 v32.93,2.43 31.53,2.63 v25.15,3.56 23.88,4.08 17.78,6.6 v17.7,6.67 16.34,7.7 v11.47,11.4 | v11.47,11.4 11.43,11.43 11.11,11.86 | 11.11,11.86 v6.65,17.72 | v6.65,17.72 6.6,17.78 6.46,18.13 | 6.46,18.13 v3.56,25.15 3.49,25.68 v2.54,33.02 2.67,34.05 v3.56,40.89 3.93,41.81 v6.6,48.26 7.51,49.45 v11.43,54.61 11.87,54.95 v17.78,59.44 19.99,59.32 20.75,59.72 25.15,62.48 v25.08,62.51 26.43,62.65 v33.02,63.5 | v54.66,54.55 55.33,53.66 | v59.39,48.32 59.61,47.84 | v62.46,40.96 62.55,40.36 | v54.67,11.51 54.33,11.21 | v11.47,11.4 11.11,11.86 | v6.65,17.72 6.46,18.13
VCCIO  (via drill 0.38)
  Top 0.305: U2.20 17.8,37.96 17.53,38.23 17.53,39.75 v17.27,40.01 C4.2 | U2.11 22.81,41.02 23.62,41.02 23.75,40.89 | U2.10 23.75,40.89 | LED25.A v23.57,42.55 | v24.89,40.39 24.89,41.29 LED26.A 24.51,41.53 23.75,40.89
  Bottom 0.305: v23.57,42.55 23.24,42.16 23.24,39.62 23.5,39.37 | 23.5,39.37 24.64,39.37 24.89,39.62 v24.89,40.39 | v17.27,40.01 17.91,39.37 23.5,39.37

### Text on the board
tNames: - | + | v1.5 | PULSAR | BLE BLINKY | Pasadena, CA | https://acrobotic.com | CR1025